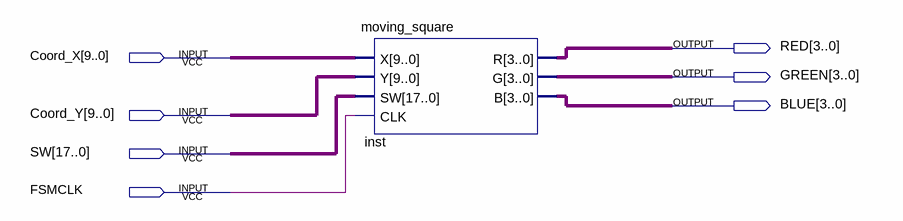
[diagram p0: schematic sheet]
// Quartus schematic video_generator.bdf as structural Verilog: 1 symbols, 7 pins
module video_generator (
  input  [9:0] Coord_X,
  input  [9:0] Coord_Y,
  input  [17:0] SW,
  input  FSMCLK,
  output [3:0] RED,
  output [3:0] GREEN,
  output [3:0] BLUE
);

  moving_square inst (.X(Coord_X), .Y(Coord_Y), .SW(SW), .CLK(FSMCLK), .R(RED), .G(GREEN), .B(BLUE));
endmodule
